# EAGLE design main (EAGLE 6.5.0)
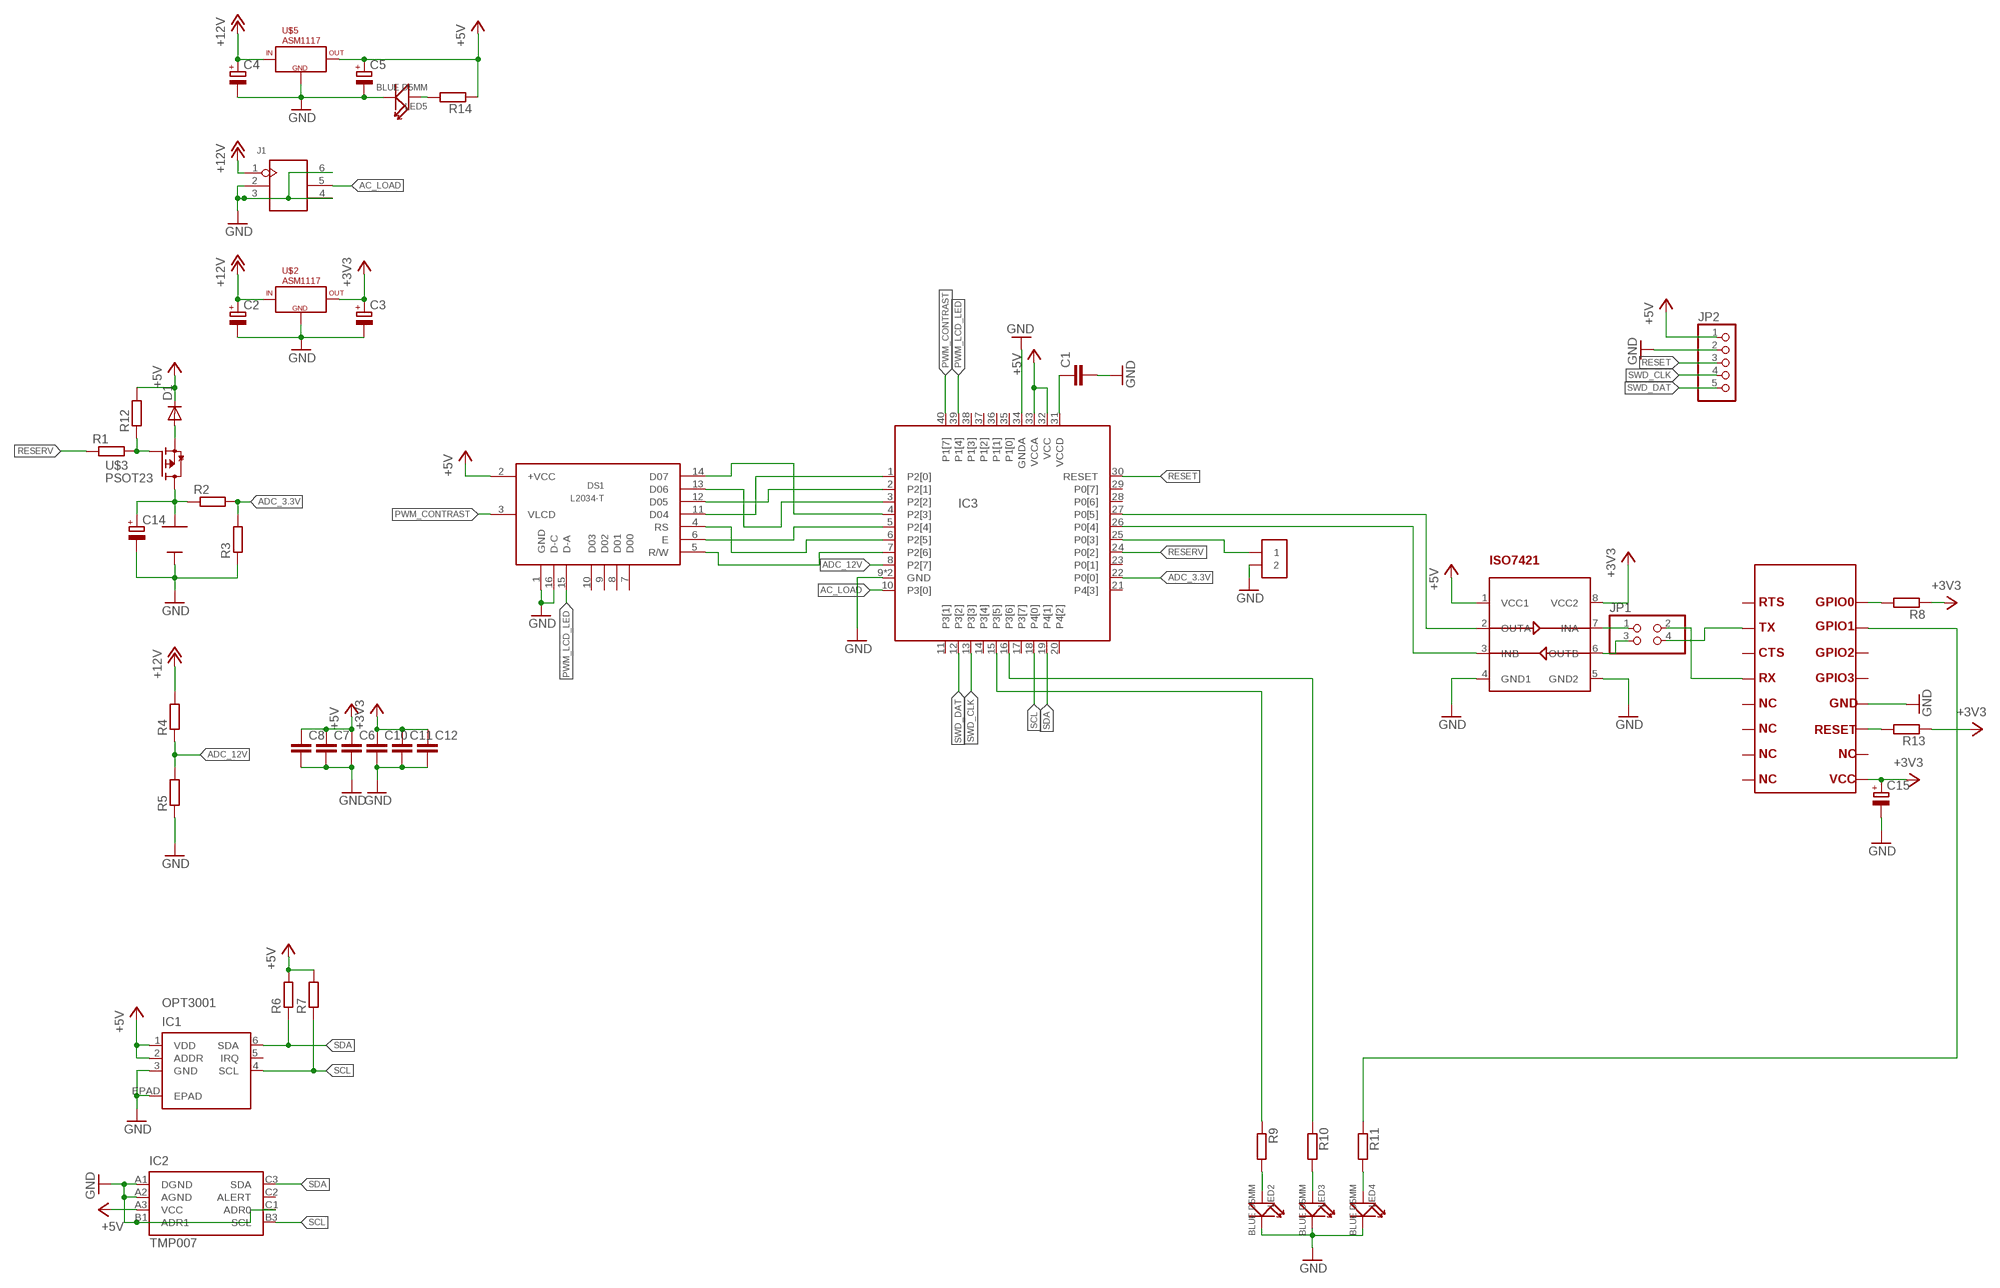
[diagram p0: schematic, sheet 1]

## Parts
BAT1  CR2032_DIP  [CR2032_DIP]
C1  C-EUC0805  [C0805]
C2  CPOL-EU150CLZ-0810  [150CLZ-0810]
C3  CPOL-EU150CLZ-0810  [150CLZ-0810]
C4  CPOL-EU150CLZ-0810  [150CLZ-0810]
C5  CPOL-EU150CLZ-0810  [150CLZ-0810]
C6  C-EUC0805  [C0805]
C7  C-EUC0805  [C0805]
C8  C-EUC0805  [C0805]
C10  C-EUC0805  [C0805]
C11  C-EUC0805  [C0805]
C12  C-EUC0805  [C0805]
C14  CPOL-EUSMCD  [SMC_D]
C15  CPOL-EUSMCA  [SMC_A]
D1  DIODE-DO-214AC  [DO-214AC]
DS1  L2034-T  [L2034-T]
IC1  OPT3001  [USON6]
IC2  TMP007  [XBGA8]
IC3  CY8C4245-LQI-LONG  [QFN40-LONG]
J1  DIP-BLUE-MALE-HEADER-VERT(2X3P-2.54)  [H2X3-2.54]
JP1  PINHD-2X2  [2X02]
JP2  PINHD-1X5  [1X05]
LED2  BLUE D5MM  DIP-LED-BLUE-BLUE-5MM(2P-D5MM)  [LED2-2.54-D5.0MM]
LED3  BLUE D5MM  DIP-LED-BLUE-BLUE-5MM(2P-D5MM)  [LED2-2.54-D5.0MM]
LED4  BLUE D5MM  DIP-LED-BLUE-BLUE-5MM(2P-D5MM)  [LED2-2.54-D5.0MM]
LED5  BLUE D5MM  DIP-LED-BLUE-BLUE-5MM(2P-D5MM)  [LED2-2.54-D5.0MM]
R1  R-EU_M0805  [M0805]
R2  R-EU_M0805  [M0805]
R3  R-EU_M0805  [M0805]
R4  R-EU_M0805  [M0805]
R5  R-EU_M0805  [M0805]
R6  R-EU_M0805  [M0805]
R7  R-EU_M0805  [M0805]
R8  R-EU_M0805  [M0805]
R9  R-EU_M0805  [M0805]
R10  R-EU_M0805  [M0805]
R11  R-EU_M0805  [M0805]
R12  R-EU_M0805  [M0805]
R13  R-EU_M0805  [M0805]
R14  R-EU_M0805  [M0805]
U$1  HM-11  [HM-11]
U$2  ASM1117  [SOT223]
U$3  PSOT23  [SOT23]
U$5  ASM1117  [SOT223]
U$6  ISO7421  [SO8]
U$7  1X2  [1X2]

## Nets
+3V3: C3.+ C10.1 C11.1 C12.1 C15.+ R8.1 R13.1 U$1.9 U$2.2(OUT) U$2.4(OUT) U$6.8(VCC2)
+5V: C5.+ C6.1 C7.1 C8.1 D1.C DS1.2(+VCC) IC1.1(VDD) IC1.2(ADDR) IC2.A3(VCC) IC3.32(VCC) IC3.33(VCCA) JP2.1 R6.2 R7.2 R12.2 R14.1 U$5.2(OUT) U$5.4(OUT) U$6.1(VCC1)
+12V: C2.+ C4.+ J1.1 R4.2 U$2.3(IN) U$5.3(IN)
AC_LOAD: IC3.10(P3[0]) J1.5
ADC_3.3V: IC3.22(P0[0]) R2.2 R3.2
ADC_12V: IC3.8(P2[7]) R4.1 R5.2
GND: BAT1.- C1.2 C2.- C3.- C4.- C5.- C6.2 C7.2 C8.2 C10.2 C11.2 C12.2 C14.- C15.- DS1.1(GND) DS1.16(D-C) IC1.3(GND) IC1.EPAD IC2.A1(DGND) IC2.A2(AGND) IC2.B1(ADR1) IC2.C1(ADR0) IC3.9(GND) IC3.34(GNDA) IC3.41(GND) J1.2 J1.3 J1.4 J1.6 JP2.2 LED2.- LED3.- LED4.- LED5.- R3.1 R5.1 U$1.12 U$2.1(GND) U$5.1(GND) U$6.4(GND1) U$6.5(GND2) U$7.2
N$1: IC3.25(P0[3]) U$7.1
N$2: C1.1 IC3.31(VCCD)
N$5: LED5.+ R14.2
N$6: JP1.1 U$6.7(INA)
N$7: DS1.11(D04) IC3.1(P2[0])
N$8: DS1.12(D05) IC3.2(P2[1])
N$9: DS1.13(D06) IC3.3(P2[2])
N$10: DS1.14(D07) IC3.4(P2[3])
N$11: DS1.6(E) IC3.5(P2[4])
N$12: DS1.4(RS) IC3.6(P2[5])
N$13: DS1.5(R/W) IC3.7(P2[6])
N$14: JP1.3 U$6.6(OUTB)
N$15: JP1.4 U$1.2
N$16: R13.2 U$1.11
N$17: JP1.2 U$1.4
N$18: BAT1.+ C14.+ R2.1 U$3.S
N$19: R1.2 R12.1 U$3.G
N$20: R8.2 U$1.16
N$21: LED2.+ R9.2
N$22: LED3.+ R10.2
N$23: LED4.+ R11.2
N$24: R11.1 U$1.15
N$25: IC3.16(P3[6]) R10.1
N$26: IC3.15(P3[5]) R9.1
N$27: IC3.27(P0[5]) U$6.2(OUTA)
N$28: IC3.26(P0[4]) U$6.3(INB)
N$29: D1.A U$3.D
PWM_CONTRAST: DS1.3(VLCD) IC3.40(P1[7])
PWM_LCD_LED: DS1.15(D-A) IC3.39(P1[4])
RESERV: IC3.24(P0[2]) R1.1
RESET: IC3.30(RESET) JP2.3
SCL: IC1.4(SCL) IC2.B3(SCL) IC3.18(P4[0]) R7.1
SDA: IC1.6(SDA) IC2.C3(SDA) IC3.19(P4[1]) R6.1
SWD_CLK: IC3.13(P3[3]) JP2.4
SWD_DAT: IC3.12(P3[2]) JP2.5
Unconnected: DS1.7(D00) DS1.8(D01) DS1.9(D02) DS1.10(D03) IC1.5(IRQ) IC2.C2(ALERT) IC3.11(P3[1]) IC3.14(P3[4]) IC3.17(P3[7]) IC3.20(P4[2]) IC3.21(P4[3]) IC3.23(P0[1]) IC3.28(P0[6]) IC3.29(P0[7]) IC3.35(P1[0]) IC3.36(P1[1]) IC3.37(P1[2]) IC3.38(P1[3]) U$1.1 U$1.3 U$1.5 U$1.6 U$1.7 U$1.8 U$1.10 U$1.13 U$1.14

## Library data of the parts
BAT1 = Battery_case:CR2032_DIP
C1 C6-C8 C10-C12 = rcl:C-EU: CAPACITOR, European symbol
C2-C5 C14 C15 = rcl:CPOL-EU: POLARIZED CAPACITOR, European symbol
D1 = diode:DIODE-: DIODE
DS1 = abi-lcd:L2034-T
IC1 = My_TI:OPT3001: OPT3001 edit this description Auto generated by make-symbol-device-package-bsdl.ulp Rev. 43 Source: OPT3001.txt
IC2 = My_TI:TMP007: TMP007 edit this description Auto generated by make-symbol-device-package-bsdl.ulp Rev. 43 Source: TMP007.txt
IC3 = PsoC:CY8C4245-LQI-LONG: CY8C4245-LQI edit this description Auto generated by make-symbol-device-package-bsdl.ulp Rev. 44 Source: CY8C4245-LQI.txt
J1 = Seeed-OPL-Connector:DIP-BLUE-MALE-HEADER-VERT(2X3P-2.54): 320020003; MPN: P125-1203A0BS116A1
JP1 = pinhead:PINHD-2X2: PIN HEADER
JP2 = pinhead:PINHD-1X5: PIN HEADER
LED2-LED5 = Seeed-OPL-Diode:DIP-LED-BLUE-BLUE-5MM(2P-D5MM): 304090160; MPN: BH504DC
R1-R14 = rcl:R-EU_: RESISTOR, European symbol
U$1 = Interface:HM-11
U$2 U$5 = 74xx:ASM1117
U$3 = Mosfet_Logic:PSOT23
U$6 = Interface:ISO7421
U$7 = myPinhead:1X2

## Board
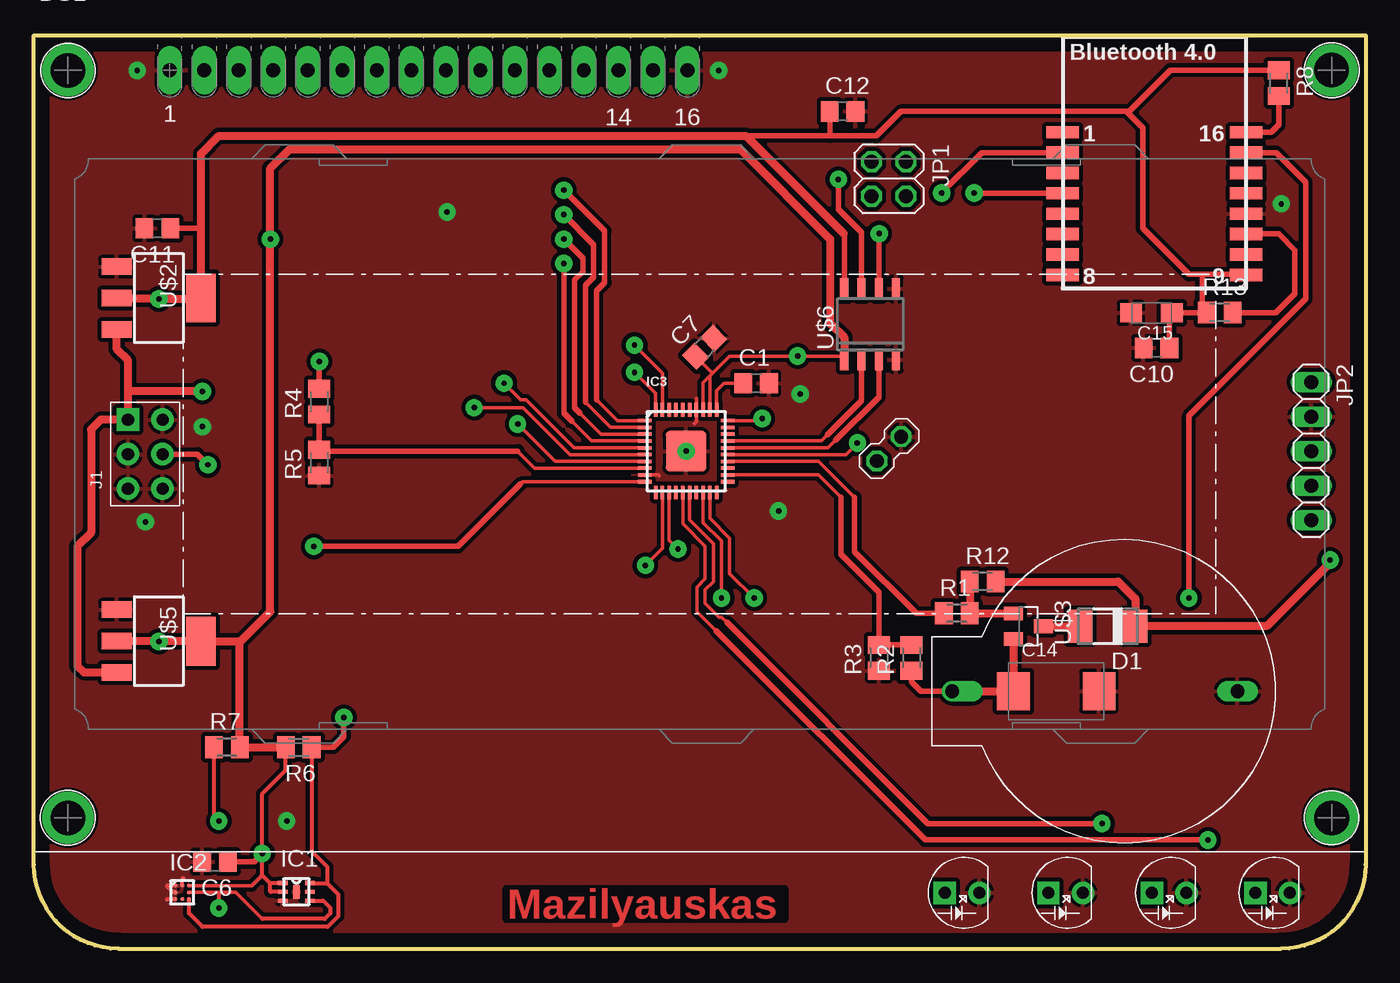
[diagram p1: board, top side]
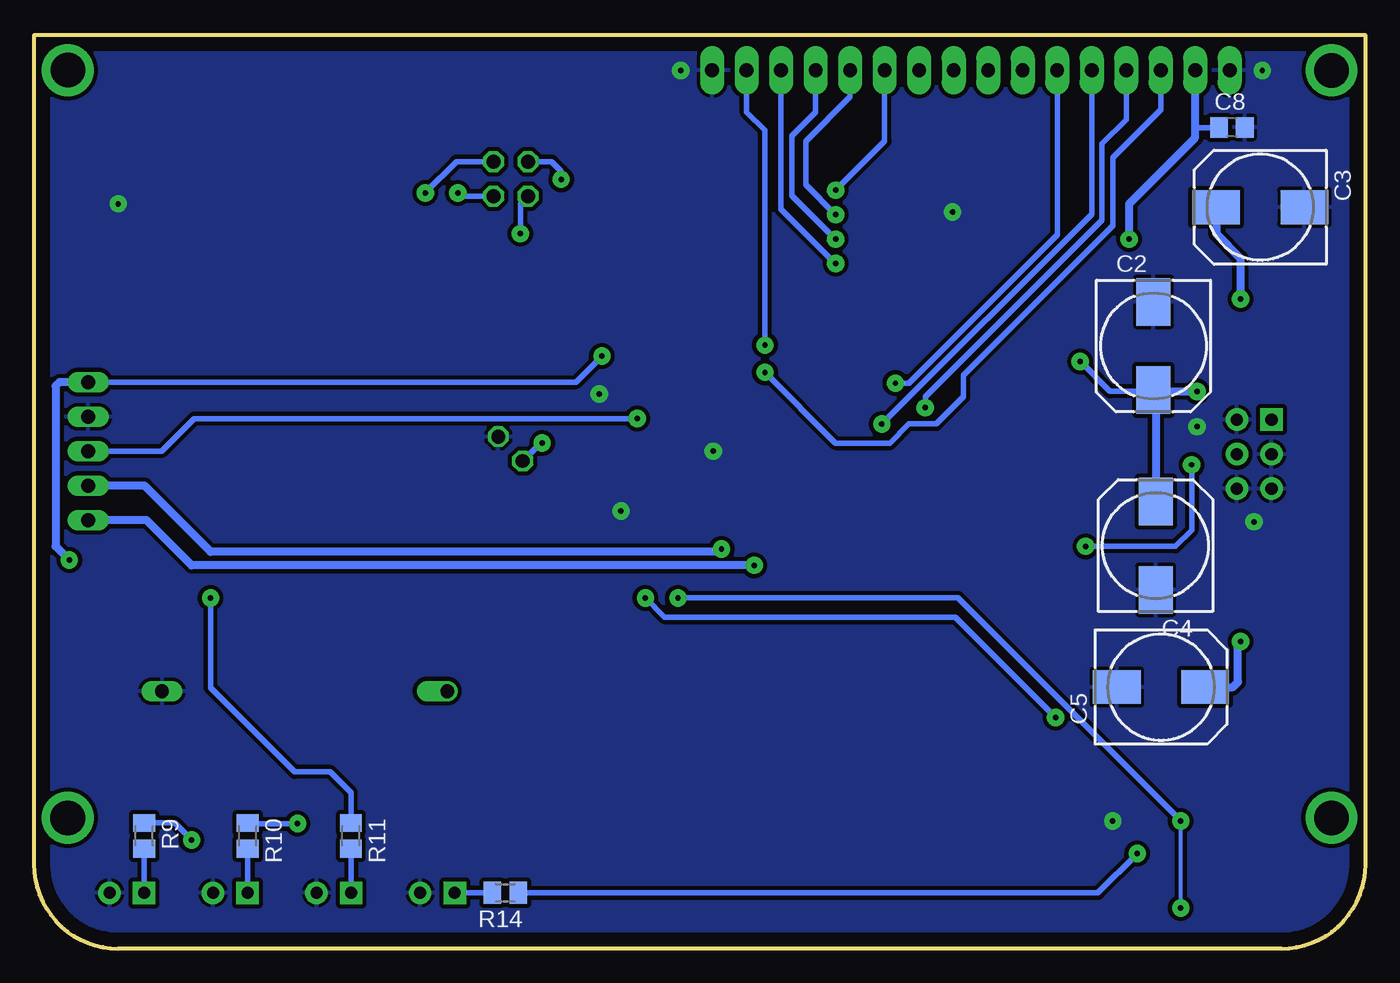
[diagram p2: board, bottom side, seen from below]

Size 98 x 67.2 mm. Coordinates in mm from the lower left corner, seen from the top.
Outline: 0,67.2 98,67.2 98,6.2 arc-90 91.8,0 6.2,0 arc-90 0,6.2 0,67.2
Copper layers (1*16): Top 0.035mm / dielectric 1.5mm / Bottom 0.035mm
Design rules "default": minimum track width 10mil, minimum drill 24mil, track to track 8mil, track to pad 8mil, pad to pad 8mil, via to via 8mil, smd to smd 8mil, copper to edge 40mil, drill to drill 8mil, minimum pad ring 10mil, minimum via ring 8mil, stop-mask expansion 4mil, vias tented up to drill 0mil, thermal gap 10mil

### Footprints (pad centres in the part's own frame; a part is rotated, then mirrored left to right if it is on the bottom)
CR2032_DIP = drill 1 offset: + -12.5,0 | drill 1 long: - 8.5,0
C0805 = smd 1.3 x 1.5: 1 -0.95,0; 2 0.95,0
150CLZ-0810 = smd 3.5 x 2.5: + 3.25,0; - -3.25,0
SMC_D = smd 2.4 x 2.8: + -3.15,0; - 3.15,0
SMC_A = smd 1.6 x 1.4: + -1.5,0; - 1.5,0
DO-214AC = smd 1.8 x 2.4: A 2.025,0; C -2.025,0
L2034-T = drill 1.016 pad 1.778 long: 1 -38.108,27.947; 2 -35.568,27.947; 3 -33.028,27.947; 4 -30.488,27.947; 5 -27.948,27.947; 6 -25.408,27.947; 7 -22.868,27.947; 8 -20.328,27.947; 9 -17.788,27.947; 10 -15.248,27.947; 11 -12.708,27.947; 12 -10.168,27.947; 13 -7.628,27.947; 14 -5.088,27.947; 15 -2.548,27.947; 16 -0.008,27.947 | drill 2.54 pad 3.81: P$1 -45.605,27.937; P$2 -45.595,-27.053; P$3 47.415,-27.053; P$4 47.405,27.947
USON6 = smd 0.7 x 0.3: 1 -1,0.65; 2 -1,0; 3 -1,-0.65; 4 1,-0.65; 5 1,0; 6 1,0.65 | smd 0.5 x 1: EPAD 0,0
XBGA8 = smd 0.3 x 0.3: A1 -0.5,0.5; A2 0,0.5; A3 0.5,0.5; B1 -0.5,0; B3 0.5,0; C1 -0.5,-0.5; C2 0,-0.5; C3 0.5,-0.5
QFN40-LONG = smd 1 x 0.26: 1 -3.05,2.25; 2 -3.05,1.75; 3 -3.05,1.25; 4 -3.05,0.75; 5 -3.05,0.25; 6 -3.05,-0.25; 7 -3.05,-0.75; 8 -3.05,-1.25; 9 -3.05,-1.75; 10 -3.05,-2.25; 21 3.05,-2.25; 22 3.05,-1.75; 23 3.05,-1.25; 24 3.05,-0.75; 25 3.05,-0.25; 26 3.05,0.25; 27 3.05,0.75; 28 3.05,1.25; 29 3.05,1.75; 30 3.05,2.25 | smd 0.26 x 1: 11 -2.25,-3.05; 12 -1.75,-3.05; 13 -1.25,-3.05; 14 -0.75,-3.05; 15 -0.25,-3.05; 16 0.25,-3.05; 17 0.75,-3.05; 18 1.25,-3.05; 19 1.75,-3.05; 20 2.25,-3.05; 31 2.25,3.05; 32 1.75,3.05; 33 1.25,3.05; 34 0.75,3.05; 35 0.25,3.05; 36 -0.25,3.05; 37 -0.75,3.05; 38 -1.25,3.05; 39 -1.75,3.05; 40 -2.25,3.05 | smd 3 x 3: 41 0,0
H2X3-2.54 = drill 0.889 pad 1.651 square: 1 -1.27,2.54 | drill 0.889 pad 1.651: 2 -1.27,0; 3 -1.27,-2.54; 4 1.27,-2.54; 5 1.27,0; 6 1.27,2.54
2X02 = drill 1.016 octagon: 1 -1.27,-1.27; 2 -1.27,1.27; 3 1.27,-1.27; 4 1.27,1.27
1X05 = drill 1.016 long: 1 -5.08,0; 2 -2.54,0; 3 0,0; 4 2.54,0; 5 5.08,0
LED2-2.54-D5.0MM = drill 0.889 pad 1.651 square: + -1.27,0 | drill 0.889 pad 1.651: - 1.27,0
M0805 = smd 1.3 x 1.6: 1 -0.95,0; 2 0.95,0
HM-11 = smd 2.4 x 0.9: 1 -6.5,2; 2 -6.5,0.5; 3 -6.5,-1; 4 -6.5,-2.5; 5 -6.5,-4; 6 -6.5,-5.5; 7 -6.5,-7; 8 -6.5,-8.5; 9 7,-8.5; 10 7,-7; 11 7,-5.5; 12 7,-4; 13 7,-2.5; 14 7,-1; 15 7,0.5; 16 7,2
SOT223 = smd 1.219 x 2.235: 1 -2.311,-3.099; 2 0,-3.099; 3 2.311,-3.099 | smd 3.6 x 2.2: 4 0,3.099
SOT23 = smd 1 x 1.4: D 0,1.1; G -0.95,-1.1; S 0.95,-1.1
SO8 = smd 0.6 x 1.6: 1 -1.905,-2.6; 2 -0.635,-2.6; 3 0.635,-2.6; 4 1.905,-2.6; 5 1.905,2.6; 6 0.635,2.6; 7 -0.635,2.6; 8 -1.905,2.6
1X2 = drill 1.016 octagon: 1 0,0; 2 -2.54,0

### Placement (x,y rotation side)
BAT1  80.07,18.94 0 top
C1  53.15,41.6 0 top
C2  15.61,44.34 270 bottom
C3  7.75,54.55 180 bottom
C4  15.45,29.65 90 bottom
C5  15.05,19.25 0 bottom
C6  13.33,6.4 180 top
C7  49.36,44.24 45 top
C8  9.84,60.42 0 bottom
C10  82.61,44.2 180 top
C11  9.09,53 180 top
C12  59.51,61.6 0 top
C14  75.23,18.94 0 top
C15  82.24,46.78 180 top
D1  79.02,23.72 180 top
DS1  48.1,36.68 0 top
IC1  19.32,4.18 0 top
IC2  10.91,4.14 0 top
IC3  48,36.6 0 top
J1  8.19,36.38 0 top
JP1  62.91,56.63 270 top
JP2  94,36.6 270 top
LED2  91.17,4.11 0 top
LED3  83.55,4.11 0 top
LED4  75.93,4.11 0 top
LED5  68.31,4.11 0 top
R1  67.92,24.67 0 top
R2  64.58,21.4 90 top
R3  62.18,21.4 90 top
R4  20.98,40.24 90 top
R5  20.98,35.76 90 top
R6  19.48,14.82 180 top
R7  14.2,14.82 0 top
R8  91.62,63.68 270 top
R9  89.89,8.3 270 bottom
R10  82.28,8.3 270 bottom
R11  74.67,8.3 270 bottom
R12  69.82,27.01 0 top
R13  87.27,46.8 0 top
R14  63.31,4.11 180 bottom
U$1  82.21,58.07 0 top
U$2  9.19,47.87 270 top
U$3  73.18,23.72 270 top
U$5  9.19,22.63 270 top
U$6  61.54,45.94 0 top
U$7  62.04,35.88 225 top

### Tracks (layer width: path | path; a pad name or v marks a point on that pad's centre or on a via)
+3V3  (via drill 0.4 pad 1.27)
  Top 0.406: 59.6,52.6 59.63,52.56 U$6.8 | U$1.9 89.18,49.6 86,49.6 | 86,49.6 85,49.6 81.6,53 81.6,60.4 80.5,61.5 | 80.5,61.5 80.4,61.6 63.8,61.6 62,59.8 58.6,59.8 | 58.6,59.8 52,59.8 | 86,49.6 86,47.12 R13.1 83.76,46.8 C15.+ 83.56,46.6 C10.1 | R8.1 83.63,64.63 80.5,61.5 | C12.1 58.6,61.56 58.6,59.8 | C11.1 12.29,53
  Top 0.6: U$2.2 6.16,47.8 v9.2,47.8 12.22,47.8 U$2.4 12.29,53 12.29,58.49 13.6,59.8 52,59.8 52.4,59.8 59.6,52.6
  Bottom 0.6: C3.+ 11,52.6 9.2,50.8 v9.2,47.8
+5V  (via drill 0.4 pad 1.27)
  Top 0.25: IC3.33 49.25,41.65 49.7,42.1 | 49.7,42.1 50,42.4 51.2,43.6 v56.2,43.6 59.38,43.6 U$6.1 | IC3.32 49.75,42.05 49.7,42.1 | IC2.A3 16.04,4.64
  Top 0.254: C7.1 49.86,42.4 50,42.4
  Top 0.305: IC1.1 17.37,4.83 | 17.37,4.83 16.8,5.4 | 16.8,5.4 v16.8,7 16.8,11.4 18.53,13.13 R6.2 | 16.04,4.64 16.8,5.4 | IC1.2 17.42,4.18 17.4,4.2 17.4,4.8 17.37,4.83
  Top 0.406: C6.1 16.2,6.4 v16.8,7
  Top 0.6: U$5.2 6.12,22.6 v9.2,22.6 9.23,22.63 U$5.4 15.23,22.63 | 15.23,22.63 17.4,24.8 v17.4,52.2 17.4,57.4 18.8,58.8 52,58.8 58.6,52.2 58.6,46 59.63,44.97 U$6.1 | v95.4,28.6 95.4,28.4 90.72,23.72 D1.C 81.05,25.75 79.79,27.01 R12.2 | 15.23,22.63 15.15,22.55 R7.2 R6.2
  Bottom 0.406: JP2.1 58.12,41.68 v56.2,43.6 | R14.1 19.69,4.11 v16.8,7 | C8.1 10.81,60.4 12.53,60.4
  Bottom 0.6: C5.+ 9.75,19.25 9.4,19.6 9.4,22.4 v9.2,22.6 | v17.4,52.2 17.4,54.8 12.53,59.67 12.53,60.4 DS1.2 | JP2.1 96.12,41.68 96.4,41.4 96.4,29.6 v95.4,28.6
+12V  (via drill 0.4 pad 1.27)
  Top 0.406: v21,43.2 20.98,43.18 R4.2
  Top 0.6: 6.92,41 J1.1 4.92,38.92 4.2,38.2 4.2,30.6 3.2,29.6 3.2,20.8 3.68,20.32 U$5.3 | 6.92,41 6.92,43.28 6.09,44.11 U$2.3 | v12.4,41 6.92,41
  Bottom 0.406: C2.+ 15.7,41 18.8,41 v21,43.2
  Bottom 0.6: C2.+ 15.45,40.93 | 15.45,40.93 C4.+ | 15.45,40.93 15.38,41 v12.4,41
AC_LOAD  (via drill 0.4 pad 1.27)
  Top 0.25: 35.8,34.2 35.95,34.35 IC3.10
  Top 0.406: J1.5 12.02,36.38 v12.8,35.6 | v20.6,29.6 31.2,29.6 35.8,34.2
  Bottom 0.406: v12.8,35.6 12.8,30.8 14,29.6 v20.6,29.6
ADC_3.3V
  Top 0.25: 59.4,33.2 57.75,34.85 IC3.22
  Top 0.406: R2.2 R3.2 62.18,26.22 59.4,29 59.4,33.2
ADC_12V
  Top 0.25: 35.6,36.6 36.85,35.35 IC3.8
  Top 0.406: R4.1 R5.2 21.09,36.6 35.6,36.6
GND  (via drill 0.4 pad 1.27)
  Top 0.25: 48.6,38.6 48.75,38.75 IC3.34 48.75,40.5 | IC3.9 45.95,34.85 46,34.8
  Top 0.305: IC2.A1 9.84,4.64 9.8,4.6 10.26,4.14 IC2.B1 | IC2.C1 9.84,3.64 9.8,3.6 | IC2.A2 10.91,5.11 11,5.2
  other vias: 56.4,40.8 18.6,9.4 91.8,54.8 48,36.6 30.4,54.2 8.2,31.4 12.4,38.4 7.6,64.6 50.4,64.6 54.8,32.2
  pour Top (isolate 0.305): 0,67.2 0,0 98,0 98,67.2
  pour Bottom (isolate 0.305): 98,67.2 98,0 0,0 0,67.2
N$1  (via drill 0.4 pad 1.27)
  Top 0.25: IC3.25 59.75,36.35 v60.6,37.2
  Bottom 0.406: v60.6,37.2 60.71,37.2 U$7.1
N$2
  Top 0.25: IC3.31 50.25,41.05 50.8,41.6 C1.1
N$5
  Bottom 0.406: R14.2 LED5.+
N$6  (via drill 0.4 pad 1.27)
  Top 0.406: U$6.7 60.91,52.7 59.2,54.4 v59.2,56.6
  Bottom 0.406: v59.2,56.6 59.2,57.2 59.9,57.9 JP1.1
N$7  (via drill 0.4 pad 1.27)
  Top 0.25: IC3.1 42.95,38.85 41.4,40.4
  Top 0.406: 41.4,40.4 41.4,48.4 42,49 42,52.8 v39,55.8
  Bottom 0.406: v39,55.8 35.39,59.41 DS1.11
N$8  (via drill 0.4 pad 1.27)
  Top 0.25: 40.6,40.2 42.45,38.35 IC3.2
  Top 0.406: v39,54 41.2,51.8 41.2,49.4 40.6,48.8 40.6,40.2
  Bottom 0.406: v39,54 41.2,56.2 41.2,59.4 37.93,62.67 DS1.12
N$9  (via drill 0.4 pad 1.27)
  Top 0.25: IC3.3 41.75,37.85 40.2,39.4
  Top 0.406: 40.2,39.4 39.8,39.8 39.8,49.2 40.4,49.8 40.4,50.8 v39,52.2
  Bottom 0.406: v39,52.2 42.2,55.4 42.2,59.8 40.47,61.53 DS1.13
N$10  (via drill 0.4 pad 1.27)
  Top 0.25: IC3.4 41.05,37.35 39.6,38.8
  Top 0.406: 39.6,38.8 39,39.4 v39,50.4
  Bottom 0.406: v39,50.4 43.01,54.41 DS1.14
N$11  (via drill 0.4 pad 1.27)
  Top 0.25: IC3.5 39.75,36.85 36.2,40.4 35.8,40.4 v34.6,41.6
  Bottom 0.406: v34.6,41.6 33.6,41.6 22.69,52.51 DS1.6
N$12  (via drill 0.4 pad 1.27)
  Top 0.25: IC3.6 39.45,36.35 36,39.8 v32.4,39.8
  Bottom 0.406: v32.4,39.8 32.4,40.6 19.4,53.6 19.4,59.2 17.61,60.99 DS1.4
N$13  (via drill 0.4 pad 1.27)
  Top 0.25: IC3.7 38.35,35.85 v35.6,38.6
  Bottom 0.406: v35.6,38.6 20.15,54.05 DS1.5
N$14  (via drill 0.4 pad 1.27)
  Top 0.406: U$6.6 62.17,52.58 v62.2,52.6
  Bottom 0.406: v62.2,52.6 62.2,54.8 JP1.3
N$15  (via drill 0.4 pad 1.27)
  Top 0.406: v66.8,55.6 69.77,58.57 U$1.2
  Bottom 0.406: JP1.4 66.56,55.36 v66.8,55.6
N$16
  Top 0.406: R13.2 91.4,46.8 92.8,48.2 92.8,51.4 91.6,52.6 89.24,52.6 U$1.11
N$17  (via drill 0.4 pad 1.27)
  Top 0.406: v69.2,55.6 69.23,55.57 U$1.4
  Bottom 0.406: JP1.2 66.9,57.9 v69.2,55.6
N$18
  Top 0.406: BAT1.+ 65.26,18.94 64.58,19.62 R2.1
  Top 0.6: BAT1.+ C14.+ U$3.S
N$19
  Top 0.6: U$3.G R1.2 R12.1
N$20
  Top 0.406: U$1.16 91.07,60.07 91.6,60.6 91.6,62.71 R8.2
N$21
  Bottom 0.406: R9.2 LED2.+
N$22
  Bottom 0.406: R10.2 | R10.2 LED3.+
N$23
  Bottom 0.406: R11.2 LED4.+
N$24  (via drill 0.4 pad 1.27)
  Top 0.406: v85,25.8 85,39.2 93.6,47.8 93.6,56.4 91.43,58.57 U$1.15
  Bottom 0.406: R11.1 74.67,11.47 76.2,13 78.8,13 85,19.2 v85,25.8
N$25  (via drill 0.4 pad 1.27)
  Top 0.25: 51,24 50.6,24.4 50.4,24.4 49.4,25.4 49.4,26.4 50,27 50,29.8 48.25,31.55 IC3.16
  Top 0.406: v78.6,9.2 65.8,9.2 51,24
  Bottom 0.406: R10.1 82.23,9.2 v78.6,9.2
N$26  (via drill 0.4 pad 1.27)
  Top 0.25: IC3.15 47.75,31.25 49.4,29.6 49.4,27.2 48.8,26.6 48.8,24.8 50.2,23.4
  Top 0.406: 50.2,23.4 65.6,8 v86.4,8
  Bottom 0.406: v86.4,8 87.65,9.25 R9.1
N$27
  Top 0.25: IC3.27 57.95,37.35 58.4,37.8
  Top 0.406: 58.4,37.8 60.91,40.3 U$6.2
N$28
  Top 0.25: IC3.26 58.45,36.85 59,37.4
  Top 0.406: 59,37.4 62.17,40.58 U$6.3
N$29
  Top 0.6: U$3.D D1.A
PWM_CONTRAST  (via drill 0.4 pad 1.27)
  Top 0.25: IC3.40 45.75,40.85 v44.2,42.4
  Bottom 0.406: DS1.3 15.07,61.73 18.6,58.2 18.6,53.2 29.6,42.2 29.6,40.6 31.6,38.6 33.6,38.6 35,37.2 39,37.2 v44.2,42.4
PWM_LCD_LED  (via drill 0.4 pad 1.27)
  Top 0.25: IC3.39 46.25,42.35 v44.2,44.4
  Bottom 0.406: v44.2,44.4 44.2,60.2 45.55,61.55 DS1.15
RESERV
  Top 0.25: IC3.24 57.75,35.85 60.4,33.2
  Top 0.406: 60.4,33.2 60.4,29.2 64.93,24.67 R1.1
RESET  (via drill 0.4 pad 1.27)
  Top 0.25: IC3.30 53.45,38.85 v53.6,39
  Bottom 0.406: v53.6,39 86.2,39 88.6,36.6 JP2.3
SCL  (via drill 0.4 pad 1.27)
  Top 0.25: 16.8,2.2 14.86,4.14 13.74,4.14 | 13.74,4.14 IC2.B3 | 13.74,4.14 13.6,4 | IC3.18 49.25,31.35 50.6,30 v50.6,25.8
  Top 0.305: IC1.4 21.27,3.53 21.8,3 21.8,2.6 21.4,2.2 16.8,2.2 | 13.6,4 v13.6,3 | v13.6,9.4 13.25,9.75 R7.1
  Bottom 0.305: v13.6,3 v13.6,9.4
  Bottom 0.406: v50.6,25.8 30,25.8 v13.6,9.4
SDA  (via drill 0.4 pad 1.27)
  Top 0.25: IC3.19 49.75,31.65 51.2,30.2 51.2,27.6 v53,25.8
  Top 0.305: IC1.6 21.57,4.83 | 21.57,4.83 22.4,4 22.4,2.4 21.6,1.6 12.4,1.6 11.41,2.59 IC2.C3 | R6.1 20.43,7.17 21.57,6.03 21.57,4.83
  Top 0.406: v22.8,17 22.8,15.6 22.02,14.82 R6.1
  Bottom 0.406: v53,25.8 51.6,24.4 30.2,24.4 v22.8,17
SWD_CLK  (via drill 0.4 pad 1.27)
  Top 0.25: IC3.13 46.75,30.05 v47.4,29.4
  Bottom 0.6: v47.4,29.4 47.6,29.2 85,29.2 89.86,34.06 JP2.4
SWD_DAT  (via drill 0.4 pad 1.27)
  Top 0.25: IC3.12 46.25,29.45 v45,28.2
  Bottom 0.6: v45,28.2 86.4,28.2 89.72,31.52 JP2.5

### Text on the board
Top: Mazilyauskas
tStop: Mazilyauskas